# Altium project 室内环境检测系统.PrjPcb
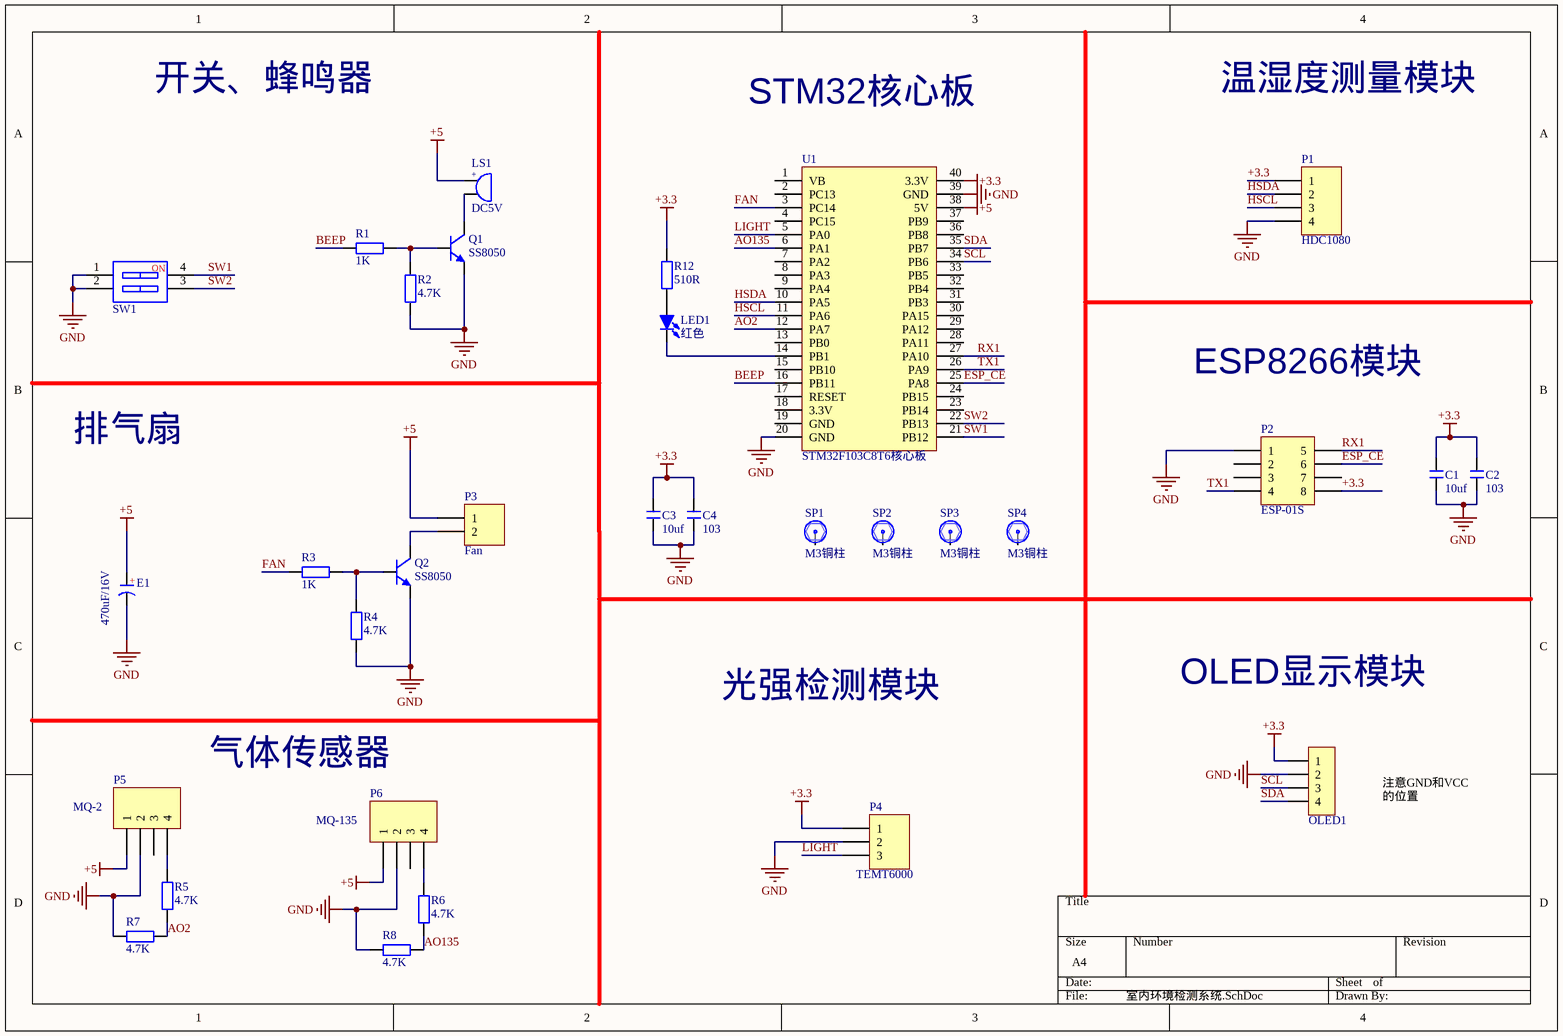
[diagram p0: 室内环境检测系统.SchDoc]
1 sheet, 31 parts. Net scope: global (net labels, ports and power ports of the same name join across sheets).
Board file: 室内环境检测系统.PcbDoc

## Sheet 室内环境检测系统.SchDoc
size A4

### Parts
C1  10uf  [R 0805_M]
C2  103  [R 0805_M]
C3  10uf  [R 0805_M]
C4  103  [R 0805_M]
E1  470uF/16V  [CAP 2.0*5*11 - BK]
LED1  红色  [LED 0805R]
LS1  DC5V  [BEEP 5x9x5.5]
OLED1  HDR-1X4  [HDR2.54-M-LI-4P]  (value not drawn)
P1  HDC1080  [HDR1X4]
P2  ESP-01S  [HDR2X4_CEN]
P3  Fan  [HDR1X2H]
P4  TEMT6000  [HDR1X3]
P5  MQ-2  [HDR1X4]
P6  MQ-135  [HDR1X4]
Q1  SS8050  [TO92A]
Q2  SS8050  [TO92A]
R1  1K  [R 0805_M]
R2  4.7K  [R 0805_M]
R3  1K  [R 0805_M]
R4  4.7K  [R 0805_M]
R5  4.7K  [R 0805_M]
R6  4.7K  [R 0805_M]
R7  4.7K  [R 0805_M]
R8  4.7K  [R 0805_M]
R12  510R  [R 0805_M]
SP1  M3铜柱  [M3x4_L]
SP2  M3铜柱  [M3x4_L]
SP3  M3铜柱  [M3x4_L]
SP4  M3铜柱  [M3x4_L]
SW1  CSW-2P  [CSW DIP-2P]  (value not drawn)
U1  STM32F103C8T6核心板  [DIP40-600_MH]

### Nets
+3.3: C1.1 C2.1 C3.1 C4.1 OLED1.1 P1.1 P2.8 P4.1 R12.2 U1.40(3.3V)
+5: E1.1(A) LS1.1 P3.1 P5.1 P6.1 U1.38(5V)
GND: C1.2 C2.2 C3.2 C4.2 E1.2(K) OLED1.2 P1.4 P2.1 P4.2 P5.2 P6.2 Q1.1(E) Q2.1(E) R2.1 R4.1 R7.2 R8.2 SW1.1 SW1.2 U1.20(GND) U1.39(GND)
AO2: R5.2 R7.1 U1.12(PA7)
AO135: R6.2 R8.1 U1.6(PA1)
BEEP: R1.1 U1.16(PB11)
ESP_CE: P2.6 U1.25(PA8)
FAN: R3.1 U1.3(PC14)
HSCL: P1.3 U1.11(PA6)
HSDA: P1.2 U1.10(PA5)
LIGHT: P4.3 U1.5(PA0)
RX1: P2.5 U1.27(PA10)
SCL: OLED1.3 U1.34(PB6)
SDA: OLED1.4 U1.35(PB7)
SW1: SW1.4 U1.21(PB12)
SW2: SW1.3 U1.22(PB13)
TX1: P2.4 U1.26(PA9)
NetLED1_1: LED1.1(A) R12.1
NetLED1_2: LED1.2(K) U1.14(PB1)
NetLS1_2: LS1.2 Q1.3(C)
NetP3_2: P3.2 Q2.3(C)
NetP5_4: P5.4 R5.1
NetP6_4: P6.4 R6.1
NetQ1_2: Q1.2(B) R1.2 R2.2
NetQ2_2: Q2.2(B) R3.2 R4.2

Not connected (* = marked no-connect by the designer): P2 2 3 7; P5 3; P6 3; SP1 1; SP2 1; SP3 1; SP4 1; U1 1(VB) 2(PC13) 4(PC15) 7(PA2) 8(PA3) 9(PA4) 13(PB0) 15(PB10) 17(RESET) 18(3.3V) 19(GND) 23(PB14) 24(PB15) 28(PA11) 29(PA12) 30(PA15) 31(PB3) 32(PB4) 33(PB5) 36(PB8) 37(PB9)

### Notes on the sheet
- 开关、蜂鸣器
- STM32核心板
- 温湿度测量模块
- ESP8266模块
- 排气扇
- 光强检测模块
- OLED显示模块
- 气体传感器
- 注意GND和VCC的位置
- (in symbol BEEP) +
- (in symbol C-CAP) +
- (in symbol CSW-2P) NO

### Library data of the parts
C1-C4 = C-CC: 直插瓷片电容; 版权归属: 源创客; BOM名称: 直插瓷片电容; 学习资源: www.ooocke.com
E1 = C-CAP: 直插电解电容; pin to pad: 1>A 2>K; 版权归属: 源创客; BOM名称: 直插电解电容; 学习资源: www.ooocke.com
LED1 = LED-SMD: 贴片LED; 版权归属: 源创客; BOM名称: 贴片LED; 学习资源: www.ooocke.com
LS1 = BEEP: 蜂鸣器; 版权归属: 源创客; BOM名称: 蜂鸣器; 学习资源: www.ooocke.com
OLED1 = Header 4: 4P接插件; 版权归属: 源创客; BOM名称: 4P接插件; 学习资源: www.ooocke.com
P1 P5 P6 = Header 4: Header, 4-Pin; LatestRevisionDate: 17-Jul-2002; LatestRevisionNote: Re-released for DXP Platform.; Publisher: Altium Limited
P2 = Header 4X2A: Header, 4-Pin, Dual row; LatestRevisionDate: 17-Jul-2002; LatestRevisionNote: Re-released for DXP Platform.; Publisher: Altium Limited
P3 = Header 2H: Header, 2-Pin, Right Angle; LatestRevisionDate: 17-Jul-2002; LatestRevisionNote: Re-released for DXP Platform.; Publisher: Altium Limited
P4 = Header 3: Header, 3-Pin; LatestRevisionDate: 17-Jul-2002; LatestRevisionNote: Re-released for DXP Platform.; Publisher: Altium Limited
Q1 Q2 = 8050-DIP: 高频放大-NPN型; 版权归属: 源创客; 属性: 40V 1.5A 1W 100MHZ; BOM名称: 高频放大-NPN型; 学习资源: www.ooocke.com
R1-R8 R12 = R-CRR: 直插色环电阻; BOM名称: 色环电阻; 版权归属: 源创客; 学习资源: www.ooocke.com
SP1-SP4 = 铜柱小焊盘: 铜柱; 版权归属: 源创客; BOM名称: 铜柱; 学习资源: www.ooocke.com
SW1 = CSW-2P: 2路编码开关; 版权归属: 源创客; BOM名称: 2路编码开关; 学习资源: www.ooocke.com